# Altium schematic sheet Scheme.SchDoc
size A4
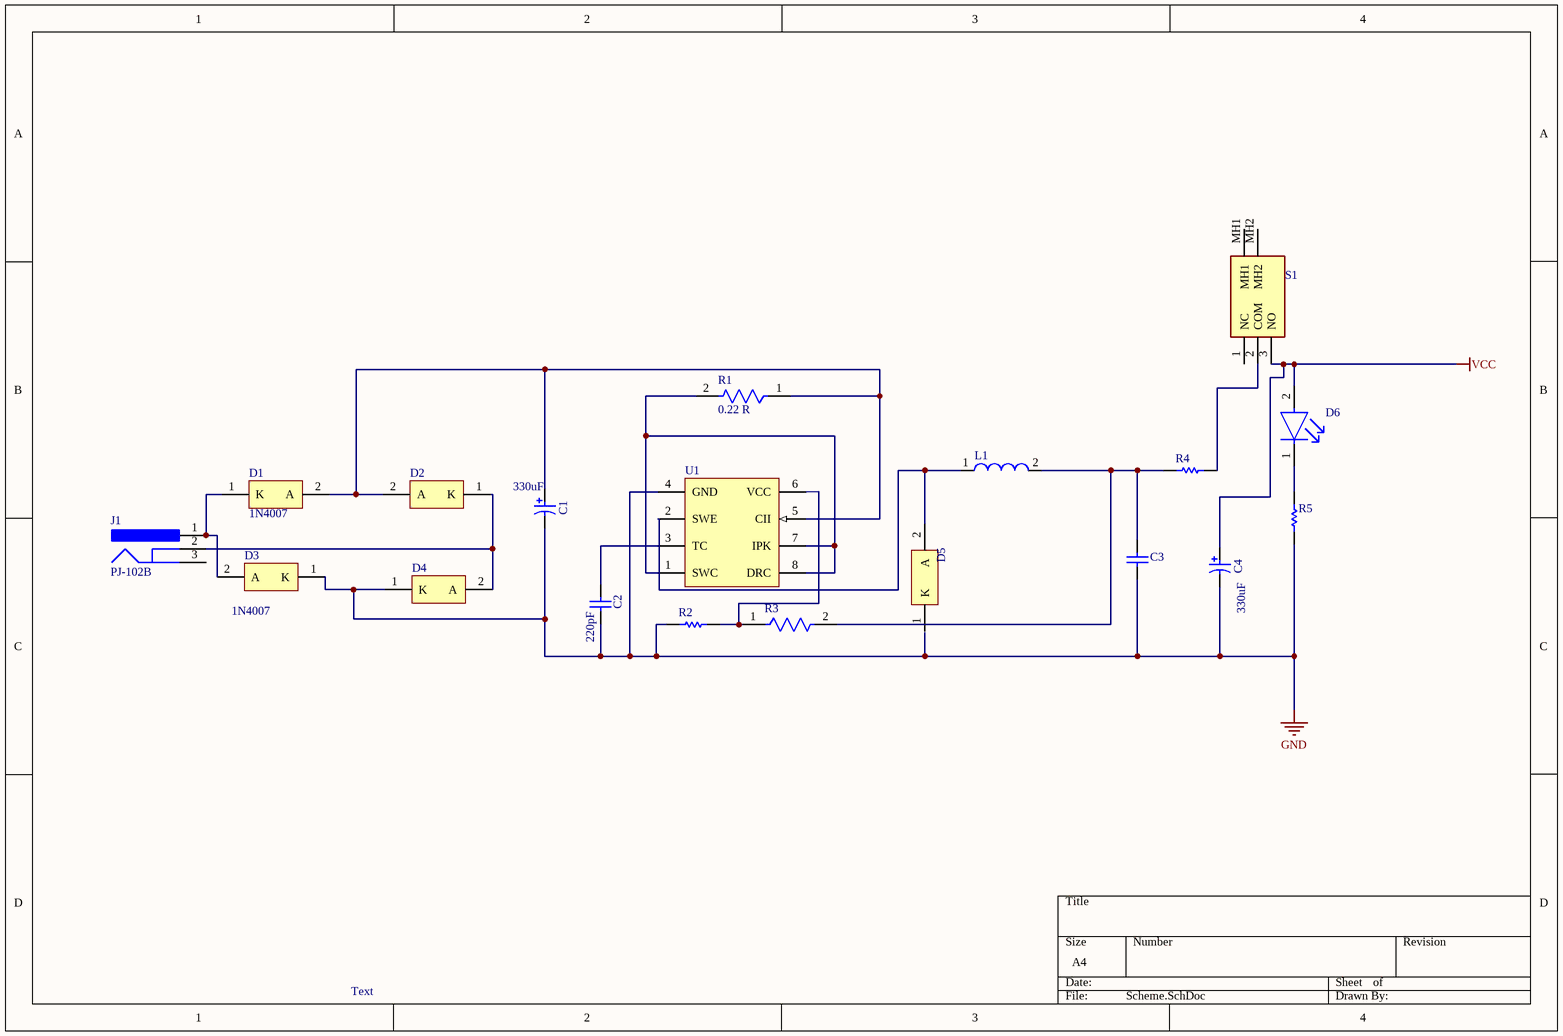
[diagram p0: Scheme.SchDoc]

## Parts
C1  EEE-FK1V331P  [PNSC-EEE-FK1V331P_L]  (value not drawn)
C2  VJ0603D201KXAAJ  [CAPC1608X92X38LL15T08]  (value not drawn)
C3  GRM188R60J106ME47D  [CAPC1608X90X35NL10T15]  (value not drawn)
C4  EEE-FK1V331P  [PNSC-EEE-FK1V331P_L]  (value not drawn)
D1  1N4007  [ONSC-AXIAL_LEAD-2-59-10_P]
D2  1N4007  [ONSC-AXIAL_LEAD-2-59-10_P]  (value not drawn)
D3  1N4007  [ONSC-AXIAL_LEAD-2-59-10_P]
D4  1N4007  [ONSC-AXIAL_LEAD-2-59-10_P]  (value not drawn)
D5  MBRS140T3G  [ONSC-SMB-2-403A-03_H_V]  (value not drawn)
D6  LTST-C190GKT  [FP-LTST-C190GKT-MFG]  (value not drawn)
J1  PJ-102B  [CUI-PJ-102B_V]
L1  744774222  [WE-PD2-M]  (value not drawn)
R1  Resistance: 0.22 R  [FP-CRCW0402-e3-IPC_C]  (hidden comment: CRCW04022K70FKED)
R2  CRCW08051K00FKEA  [RESC2013X50X30NL20T20]  (value not drawn)
R3  CRCW06033K00FKEA  [FP-CRCW0603-e3-MFG]  (value not drawn)
R4  Jumper 2512(6432)  [RESC2512(6432)_L]  (value not drawn)
R5  RC0402FR-072K2L  [RESC1005X40X25NL05T10]  (value not drawn)
S1  MS12ASW40  [MS12ASW40]  (value not drawn)
U1  MC34063ACD-TR  [SO8_M]  (value not drawn)

## Nets
GND: C1.2 C2.1 C3.1 C4.2 D3.1(K) D4.1(K) R2.1 R5.2 U1.4(GND)
VCC: C4.1 D6.2(A) S1.3(NO)
NetC1_1: C1.1 D1.2(A) D2.2(A) R1.1 U1.5(CII)
NetC2_2: C2.2 U1.3(TC)
NetC3_2: C3.2 L1.2 R3.2 R4.1
NetD1_1: D1.1(K) D3.2(A) J1.1
NetD2_1: D2.1(K) D4.2(A) J1.2
NetD5_2: D5.2(A) L1.1 U1.2(SWE)
NetD6_1: D6.1(C) R5.1
NetR1_2: R1.2 U1.1(SWC) U1.7(IPK) U1.8(DRC)
NetR2_2: R2.2 R3.1 U1.6(VCC)
NetR4_2: R4.2 S1.2(COM)

Not connected (* = marked no-connect by the designer): D5 1(K); J1 3; S1 1(NC) MH1 MH2

## Notes on the sheet
- (near C1) 330uF
- (near C2) 220pF
- (near C4) 330uF
- Text

## Library data of the parts
C1 C4 = CMP-2000-06212-1: Aluminum Electrolytic Capacitor, 330 uF, 35 V, -55 to 105 degC, 2-Pin CAPAE, RoHS, Tape and Reel; Manufacturer: Panasonic; Capacitance: 330µF; Type: Can; Impedance: 0.08O; Ripple Current: 850mA; Lifetime@Temperature: 2000Hrs@105°C; Rated Voltage: 35V; Datasheet Version: 07/2008; Manufacturer URL: http://www.panasonic.com/; Package Description: 2-Pin Capacitor Aluminum Electrolytic, Body 10.3 x 10.3 mm, Height 10.5 mm; Case Size/Dimension: Ø10x10.2mm; Datasheet URL: https://datasheet.ciiva.com/29313/443481-da-01-en-smd-elko-vfk-g-330-uf-35v-29313592.pdf; Series: FK; Mounting Technology: SurfaceMount; Package Reference: EEE-FK1V331P; Operating Temp-Max: 105°C; Operating Temp Range: -55to+105°C
C2 = CMP-2006-01502-1: Manufacturer: Vitramon; Part Number: VJ0603D201KXAAJ
C3 = CMP-2006-02792-1: Manufacturer: Murata; Part Number: GRM188R60J106ME47D
D1-D4 = CMP-0902-00142-1: Standard Recovery Rectifier, 2-Pin Axial_Lead, Pb-Free, Bulk Bag; Manufacturer: On Semiconductor; IO(rec) Max (A): 1; IFSM Max (A): 30; VRRM Max (V): 1000; ComponentLink3URL: http://www.onsemi.cn/pub_link/Collateral/59-10.PDF; PackageVersion: Rev. U, 02/2005; PackageDescription: 2-Pin, Axial Lead, Diameter 2.35 mm; PackageReference: AXIAL_LEAD-2-59-10; RoHS: TRUE; PartNumber: 1N4007; Packing: Bulk Bag; DatasheetVersion: Rev. 13; ComponentLink3Description: Package Specification; ComponentLink1Description: Manufacturer URL; ComponentLink2URL: http://www.onsemi.com/pub_link/Collateral/1N4001-D.PDF; ComponentLink1URL: http://www.onsemi.com/; Type: Standard Recovery; ComponentLink2Description: Datasheet; Mounting Technology: Through Hole
D5 = CMP-1055-00347-1: Schottky Power Rectifier, 2-Pin SMB, Pb-Free, Tape and Reel; Manufacturer: On Semiconductor; Configuration: Single; IFSM Max (A): 40; PackageDescription: 2-Pin Small Molded Package, J-Bend Lead, Body 4.33 x 3.625 mm; PartNumber: MBRS140T3G; PackageReference: SMB-2-403A-03_H; ComponentLink1URL: http://www.onsemi.com/; ComponentLink2URL: http://www.onsemi.cn/pub_link/Collateral/MBRS140T3-D.PDF; PackageVersion: Rev. H, 05/2011; ComponentLink3URL: http://www.onsemi.com/pub_link/Collateral/1SMB5913BT3-D.PDF; Packing: Tape and Reel; ComponentLink1Description: Manufacturer URL; DatasheetVersion: Rev. 9; Mounting Technology: Surface Mount; RoHS: TRUE; ComponentLink3Description: Package Specification; ComponentLink2Description: Datasheet
D6 = CMP-22017-000005-2: LED GREEN CLEAR CHIP SMD; Dominant Wavelength: 569nm; Reverse Voltage: 5V; Lens Color: Colorless; Viewing Angle: 130°; Voltage: 2V; Forward Current: 30mA; Power Dissipation: 100mW; Luminous Intensity: 6mcd; Number of LEDs: 1; Forward Voltage: 2.1V; Wavelength: 565nm; Test Current: 10mA; Min Operating Temperature: -55°C; Lens Style: Clear; Mount: Surface Mount; Width: 0.8mm; Packaging: Tape and Reel; Lens Transparency: Clear; Case Code (Metric): 1608; Depth: 0.8mm; Case Code (Imperial): 0603; Case/Package: 0603; Number of Pins: 2; Max Operating Temperature: 85°C; Lead Free: Lead Free; Number of Elements: 1; Length: 1.6mm; Height: 0.8mm; Package Quantity: 1; Power Rating: 100mW; Radiation Hardening: No; Illumination Color: Green; Color: Green
J1 = CMP-2000-06900-1: Through Hole Right Angle DC Power Jack, 2.5 A, 2.5 mm Center Pin, 3 Position, -25 to 85 degC, RoHS, Bulk; Manufacturer: CUIInc.; Insulation Resistance: 100MOhms; Inside Contact Diameter: 2.5mm; Outside Contact Diameter: 6.5mm; Voltage Rating: 24V; Current Rating: 2.5A; Brand: CUI; Datasheet URL: http://www.cui.com/product/resource/pj-102b.pdf; Housing Material: PolybutyleneTerephthalate(PBT); Operating Temperature Range: -25Cto+85C; Package Reference: PJ-102B; Factory Pack Quantity: 280; RoHS: True; Contact Material: Copper; Datasheet Version: Rev. 1.03, 04/2016; Product: Jacks; Mounting Angle: Right; Mounting Style: ThroughHole; Flammability Rating: UL94V-0; Product Category: DCPowerConnectors; Contact Gender: Male; Termination Style: ThroughHole; Manufacturer URL: http://www.cui.com/; Mounting Technology: ThroughHole; Package Description: 3-Pin Through Hole Device, Body 14.4 x 9 mm, Height 11 mm; Contact Plating: Nickel; Packaging: Bulk; Connector Type: DCPowerJack
L1 = CMP-0227-00435-1: SMD Power Inductor WE-PD2, L = 220 µH; Inductance: 220 ÂµH; ComponentLink1URL: http://www.we-online.com; ComponentLink1Description: Manufacturer Link; ComponentLink2Description: Datasheet; PackageReference: WE-PD2-M; ComponentLink2URL: http://www.we-online.de/katalog/media/pdf/744774222.pdf; PackageDescription: SMD Inductor, 2-Leads, Body 5.8 x 5.2 mm; DatasheetVersion: ver 2, Jun-2005; PackageVersion: 2005
R1 = CMP-2002-08466-2: RES Thick Film, 0.22 Ω, 1%, 0.063W, 100ppm/°C, 0402; Power Rating: 63mW; Voltage Rating (DC): 50V; Termination: SMD/SMT; Composition: Thick Film; Packaging: Tape and Reel; Tolerance: 1%; Number of Pins: 2; Contact Plating: Tin; Max Operating Temperature: 155°C; Depth: 0.5mm; Features: Automotive AEC-Q200; Lead Free: Lead Free; Number of Terminations: 2; Case/Package: 0402; Max Power Dissipation: 63mW; Radiation Hardening: No; Height: 0.35mm; Min Operating Temperature: -55°C; Width: 0.02inch; Military Standard: Not; Package Quantity: 10; Weight: 2.3E-05oz; Temperature Coefficient: 100ppm/°C; Case Code (Metric): 1005; Voltage Rating: 50V; Length: 1mm; Case Code (Imperial): 0402
R2 = CMP-1013-00510-2: Manufacturer: Vishay Dale; Part Number: CRCW08051K00FKEA
R3 = CMP-2000-03293-2: RES Thick Film, 3kΩ, 1%, 0.1W, 100ppm/°C, 0603; Voltage Rating: 75V; Resistance: 3kR; Power Rating: 100mW; Features: Automotive AEC-Q200; Radiation Hardening: No; Contact Plating: Tin; Termination: SMD/SMT; Lead Free: Lead Free; Case Code (Imperial): 0603; Case Code (Metric): 1608; Case/Package: 0603; Depth: 0.85mm; Mount: Surface Mount; Voltage Rating (DC): 75V; Tolerance: 1%; Package Quantity: 10; Temperature Coefficient: 100ppm/°C; Height: 0.45mm; Max Power Dissipation: 100mW; Composition: Thick Film; Max Operating Temperature: 155°C; Military Standard: Not; Weight: 7.1E-05oz; Length: 1.55mm; Packaging: Tape and Reel; Number of Terminations: 2; Width: 0.85mm; Min Operating Temperature: -55°C
R4 = CMP-1018-00001-1: Jumper 2512 (6432 Metric); Tolerance: None; Case-EIA: 2512; Value: 0.00 Ohm; Case-Metric: 6432; Technology: SMT; Power: None
R5 = CMP-2002-07567-1: Manufacturer: Yageo / Phycomp; Part Number: RC0402FR-072K2L
S1 = MS12ASW40: Switch; Manufacturer_Name: NKK Switches; Datasheet Link: https://www.nkkswitches.de/products/Slides/Slides%20MS/MS12ASW40/; Height: 12.7mm; Manufacturer_Part_Number: MS12ASW40; Arrow Part Number: MS12ASW40; Arrow Price/Stock: https://www.arrow.com/en/products/ms12asw40/nkk-switches; Mouser Part Number: 633-MS12ASW40; Mouser Price/Stock: https://www.mouser.com/Search/Refine.aspx?Keyword=633-MS12ASW40
U1 = CMP-0241-00016-1: DC/DC converter control circuit, 8-Pin SO, Tape and Reel; Code_IPC: SOIC127P600-8; ComponentLink2Description: Datasheet; ComponentLink3Description: Package Specification; PackageDescription: 8-Pin Small Outline Integrated Circuit 1.27 mm Pitch; Code_JEDEC: MS-012-AA; ComponentLink3URL: http://www.st.com/internet/com/TECHNICAL_RESOURCES/TECHNICAL_LITERATURE/PACKAGE_INFORMATION/CD00004680.pdf; ComponentLink1Description: Manufacturer URL; ComponentLink1URL: http://www.st.com; DatasheetVersion: Nov-2007; ComponentLink2URL: http://www.st.com/internet/com/TECHNICAL_RESOURCES/TECHNICAL_LITERATURE/DATASHEET/CD00001232.pdf; PackageReference: SO8; PackageVersion: Dec-2002